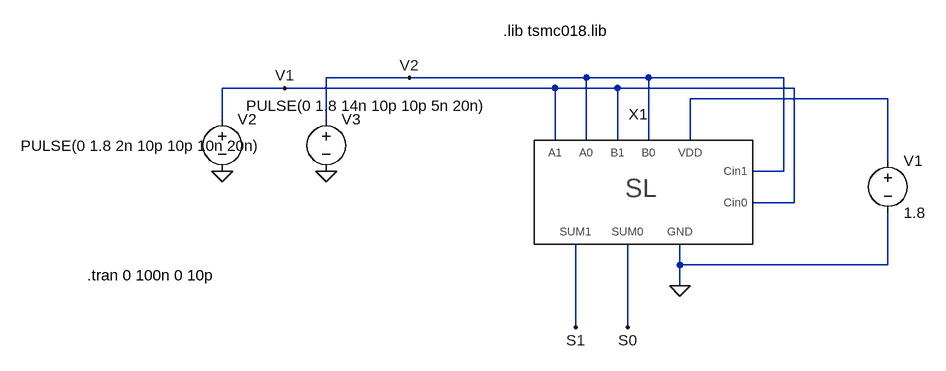
[diagram p0: schematic SL_test.asc]
SL_test.asc, the LTspice schematic file:
Version 4
SHEET 1 880 680
WIRE 32 -16 -96 -16
WIRE 304 -16 32 -16
WIRE 400 -16 304 -16
WIRE 608 -16 400 -16
WIRE -160 0 -256 0
WIRE 256 0 -160 0
WIRE 352 0 256 0
WIRE 624 0 352 0
WIRE 768 16 464 16
WIRE -256 48 -256 0
WIRE -96 48 -96 -16
WIRE 256 80 256 0
WIRE 304 80 304 -16
WIRE 352 80 352 0
WIRE 400 80 400 -16
WIRE 464 80 464 16
WIRE 768 112 768 16
WIRE 608 128 608 -16
WIRE 608 128 560 128
WIRE 624 176 624 0
WIRE 624 176 560 176
WIRE 448 272 448 240
WIRE 768 272 768 192
WIRE 768 272 448 272
WIRE 448 304 448 272
WIRE 288 368 288 240
WIRE 368 368 368 240
FLAG 448 304 0
FLAG -96 128 0
FLAG -256 128 0
FLAG -160 0 V1
FLAG 32 -16 V2
FLAG 288 368 S1
FLAG 368 368 S0
SYMBOL voltage 768 96 R0
WINDOW 123 0 0 Left 0
WINDOW 39 0 0 Left 0
SYMATTR InstName V1
SYMATTR Value 1.8
SYMBOL voltage -256 32 R0
WINDOW 3 -310 57 Left 2
WINDOW 123 0 0 Left 0
WINDOW 39 0 0 Left 0
SYMATTR Value PULSE(0 1.8 2n 10p 10p 10n 20n)
SYMATTR InstName V2
SYMBOL voltage -96 32 R0
WINDOW 3 -123 -5 Left 2
SYMATTR Value PULSE(0 1.8 14n 10p 10p 5n 20n)
SYMATTR InstName V3
SYMBOL SL 384 192 R0
SYMATTR InstName X1
TEXT 176 -88 Left 2 !.lib tsmc018.lib
TEXT -464 288 Left 2 !.tran 0 100n 0 10p

The netlist it stands for:
* SL_test.asc
V1 N001 0 1.8
V2 V1 0 PULSE(0 1.8 2n 10p 10p 10n 20n)
V3 V2 0 PULSE(0 1.8 14n 10p 10p 5n 20n)
XX1 V2 V1 V2 V1 V1 V2 0 N001 S0 S1 SL  ; pins A0 A1 B0 B1 Cin0 Cin1 GND VDD SUM0 SUM1
.lib tsmc018.lib
.tran 0 100n 0 10p
.backanno
.end